# EAGLE design fob (EAGLE 9.6.1)
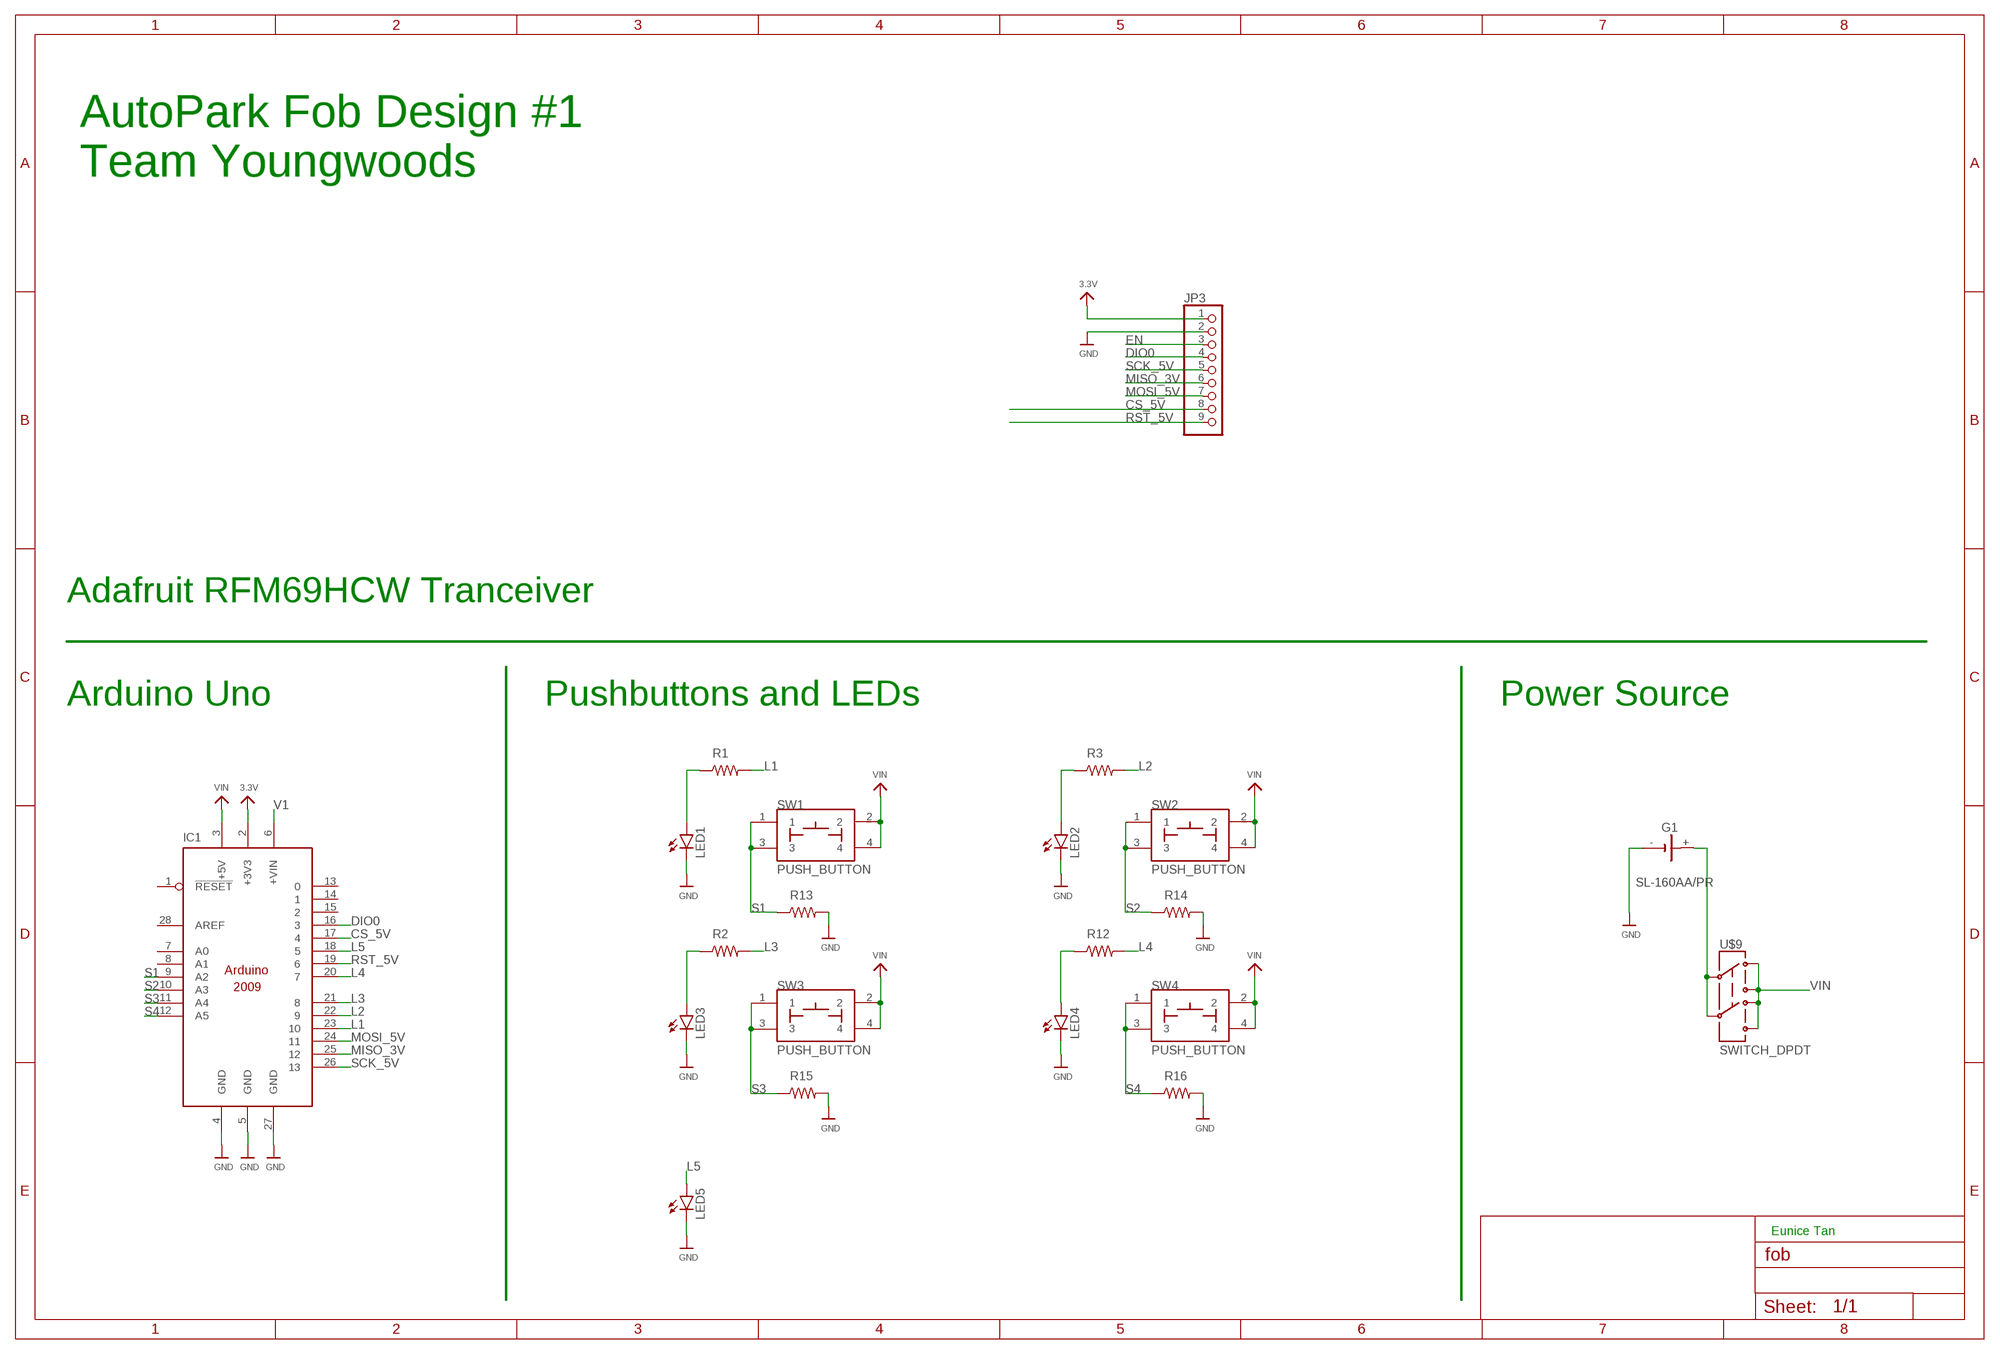
[diagram p0: schematic, sheet 1]

## Parts
G1  SL-160AA/PR  [SL-160AA/PR]
IC1  ARDUINO2009_10  [ARDUINO2009]
JP3  HEADER-1X970MIL  [1X09_ROUND_70]
LED1  LED5MM  [LED5MM]
LED2  LED5MM  [LED5MM]
LED3  LED5MM  [LED5MM]
LED4  LED5MM  [LED5MM]
LED5  LED5MM  [LED5MM]
R1  R_R0805  [R0805]
R2  R_R0805  [R0805]
R3  R_R0805  [R0805]
R12  R_R0805  [R0805]
R13  R_R0805  [R0805]
R14  R_R0805  [R0805]
R15  R_R0805  [R0805]
R16  R_R0805  [R0805]
SW1  PUSH_BUTTON  [BUTTON_12.5MM]
SW2  PUSH_BUTTON  [BUTTON_12.5MM]
SW3  PUSH_BUTTON  [BUTTON_12.5MM]
SW4  PUSH_BUTTON  [BUTTON_12.5MM]
U$9  SWITCH_DPDT  [JS_DPDT_TH]

## Nets
3.3V: IC1.2(+3V3) JP3.1
CS_5V: IC1.17 JP3.8
DIO0: IC1.16 JP3.4
EN: JP3.3
GND: G1.- IC1.4(GND) IC1.5(GND) IC1.27(GND) JP3.2 LED1.K(C) LED2.K(C) LED3.K(C) LED4.K(C) LED5.K(C) R13.2 R14.2 R15.2 R16.2
L1: IC1.23 R1.2
L2: IC1.22 R3.2
L3: IC1.21 R2.2
L4: IC1.20 R12.2
L5: IC1.18 LED5.A
MISO_3V: IC1.25 JP3.6
MOSI_5V: IC1.24 JP3.7
N$1: G1.+ U$9.2 U$9.5
N$4: LED1.A R1.1
N$5: LED3.A R2.1
N$6: LED2.A R3.1
N$7: LED4.A R12.1
RST_5V: IC1.19 JP3.9
S1: IC1.9(A2) R13.1 SW1.1 SW1.3
S2: IC1.10(A3) R14.1 SW2.1 SW2.3
S3: IC1.11(A4) R15.1 SW3.1 SW3.3
S4: IC1.12(A5) R16.1 SW4.1 SW4.3
SCK_5V: IC1.26 JP3.5
V1: IC1.6(+VIN)
VIN: IC1.3(+5V) SW1.2 SW1.4 SW2.2 SW2.4 SW3.2 SW3.4 SW4.2 SW4.4 U$9.1 U$9.3 U$9.4 U$9.6
Unconnected: IC1.1(!RESET) IC1.7(A0) IC1.8(A1) IC1.13 IC1.14 IC1.15 IC1.28(AREF)

## Notes on the sheet
- AutoPark Fob Design #1
  Team Youngwoods
- Adafruit RFM69HCW Tranceiver
- Arduino Uno | Pushbuttons and LEDs | Power Source
- Eunice Tan

## Library data of the parts
G1 = battery:SL-160AA/PR: LI BATTERY Sonnenschein
IC1 = arduino:ARDUINO2009_1: The Arduino Duemilanove ("2009") is a microcontroller board based on the ATmega168 or ATmega328. - 14 digital input/output pins (of which 6 can be used as PWM outputs) - 6 analog inputs, a 16 MHz crystal oscillator - USB connection - power jack - ISP header - reset button It contains everything needed to support the microcontroller; simply connect it to a computer with a USB cable or power it with a AC-to-DC adapter or battery to get started http://arduino.cc/en/Main/ArduinoBoardDuemilanove
JP3 = microbuilder:HEADER-1X9: PIN HEADER
LED1-LED5 = led:LED: LED OSRAM: - CHIPLED LG R971, LG N971, LY N971, LG Q971, LY Q971, LO R971, LY R971 LH N974, LH R974 LS Q976, LO Q976, LY Q976 LO Q996 - Hyper CHIPLED LW Q18S LB Q993, LB Q99A, LB R99A - SideLED LS A670, LO A670, LY A670, LG A670, LP A670 LB A673, LV A673, LT A673, LW A673 LH A674 LY A675 LS A676, LA A676, LO A676, LY A676, LW A676 LS A679, LY A679, LG A679 - Hyper Micro SIDELED® LS Y876, LA Y876, LO Y876, LY Y876 LT Y87S - SmartLED LW L88C, LW L88S LB L89C, LB L89S, LG L890 LS L89K, LO L89K, LY L89K LS L896, LA L896, LO L896, LY L896 - TOPLED LS T670, LO T670, LY T670, LG T670, LP T670 LSG T670, LSP T670, LSY T670, LOP T670, LYG T670 LG T671, LOG T671, LSG T671 LB T673, LV T673, LT T673, LW T673 LH T674 LS T676, LA T676, LO T676, LY T676, LB T676, LH T676, LSB T676, LW T676 LB T67C, LV T67C, LT T67C, LS T67K, LO T67K, LY T67K, LW E67C LS E67B, LA E67B, LO E67B, LY E67B, LB E67C, LV E67C, LT E67C LW T67C LS T679, LY T679, LG T679 LS T770, LO T770, LY T770, LG T770, LP T770 LB T773, LV T773, LT T773, LW T773 LH T774 LS E675, LA E675, LY E675, LS T675 LS T776, LA T776, LO T776, LY T776, LB T776 LHGB T686 LT T68C, LB T68C - Hyper Mini TOPLED® LB M676 - Mini TOPLED Santana® LG M470 LS M47K, LO M47K, LY M47K Source: http://www.osram.convergy.de LUXEON: - LUMILED® LXK2-PW12-R00, LXK2-PW12-S00, LXK2-PW14-U00, LXK2-PW14-V00 LXK2-PM12-R00, LXK2-PM12-S00, LXK2-PM14-U00 LXK2-PE12-Q00, LXK2-PE12-R00, LXK2-PE12-S00, LXK2-PE14-T00, LXK2-PE14-U00 LXK2-PB12-K00, LXK2-PB12-L00, LXK2-PB12-M00, LXK2-PB14-N00, LXK2-PB14-P00, LXK2-PB14-Q00 LXK2-PR12-L00, LXK2-PR12-M00, LXK2-PR14-Q00, LXK2-PR14-R00 LXK2-PD12-Q00, LXK2-PD12-R00, LXK2-PD12-S00 LXK2-PH12-R00, LXK2-PH12-S00 LXK2-PL12-P00, LXK2-PL12-Q00, LXK2-PL12-R00 Source: www.luxeon.com KINGBRIGHT: KA-3528ASYC Source: www.kingbright.com
R1-R3 R12-R16 = MISC:R_: RESISTOR, American symbol
SW1-SW4 = MISC:PUSH_BUTTON
U$9 = ELEC327:SWITCH_DPDT

## Board
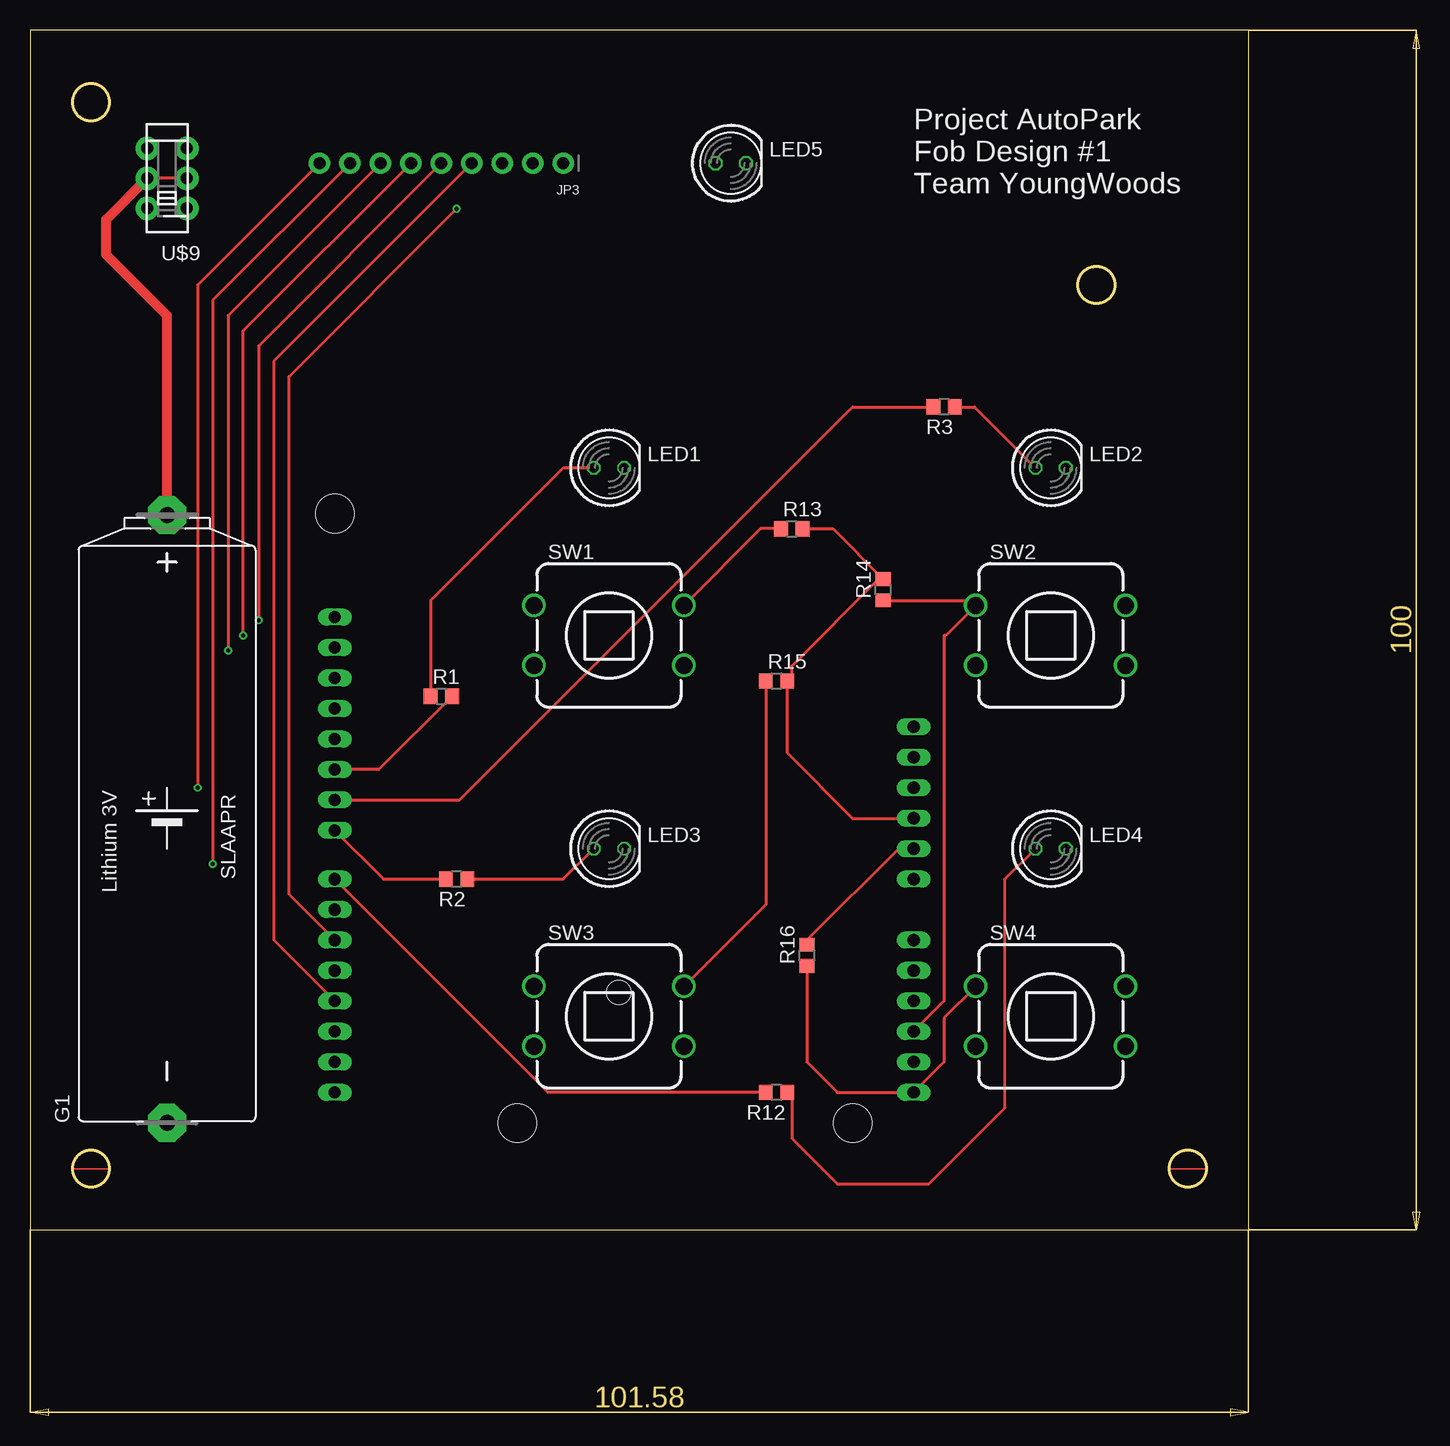
[diagram p1: board, top side]
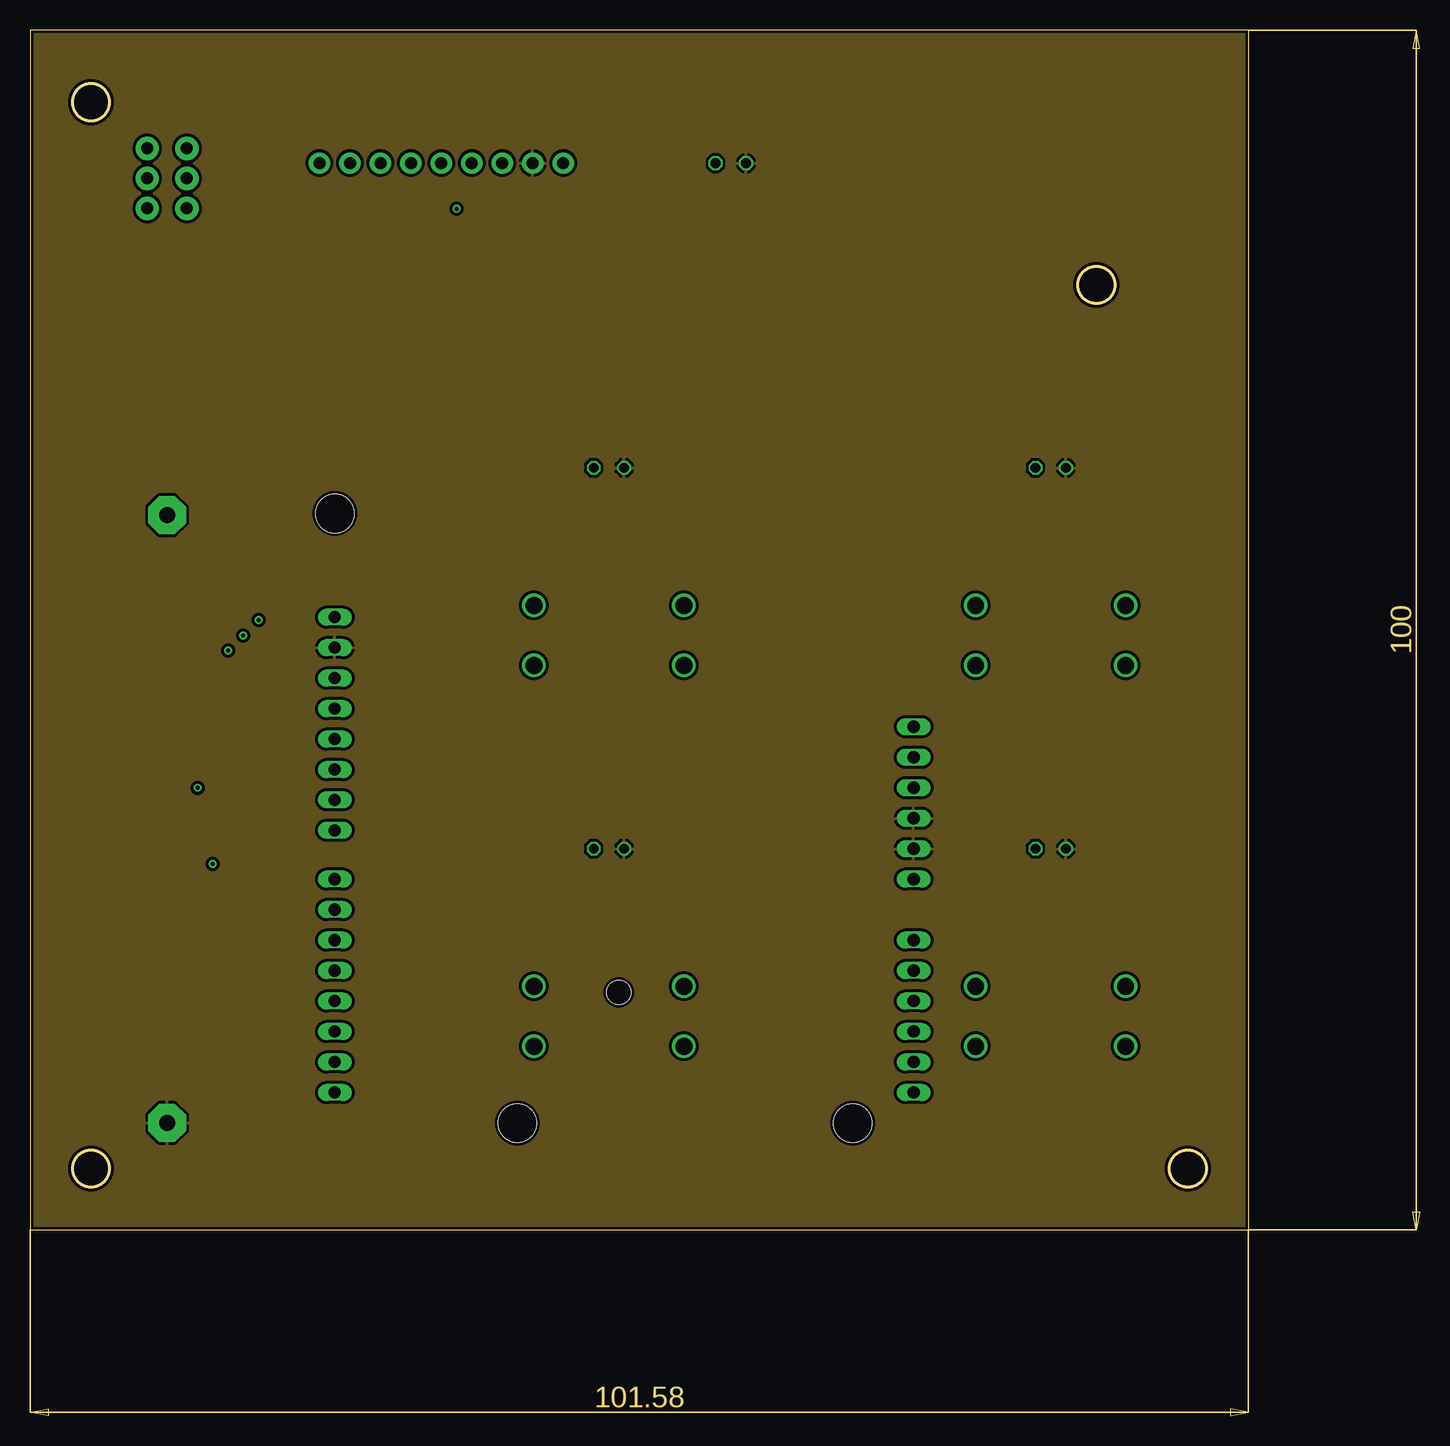
[diagram p2: board, inner layer Route2]
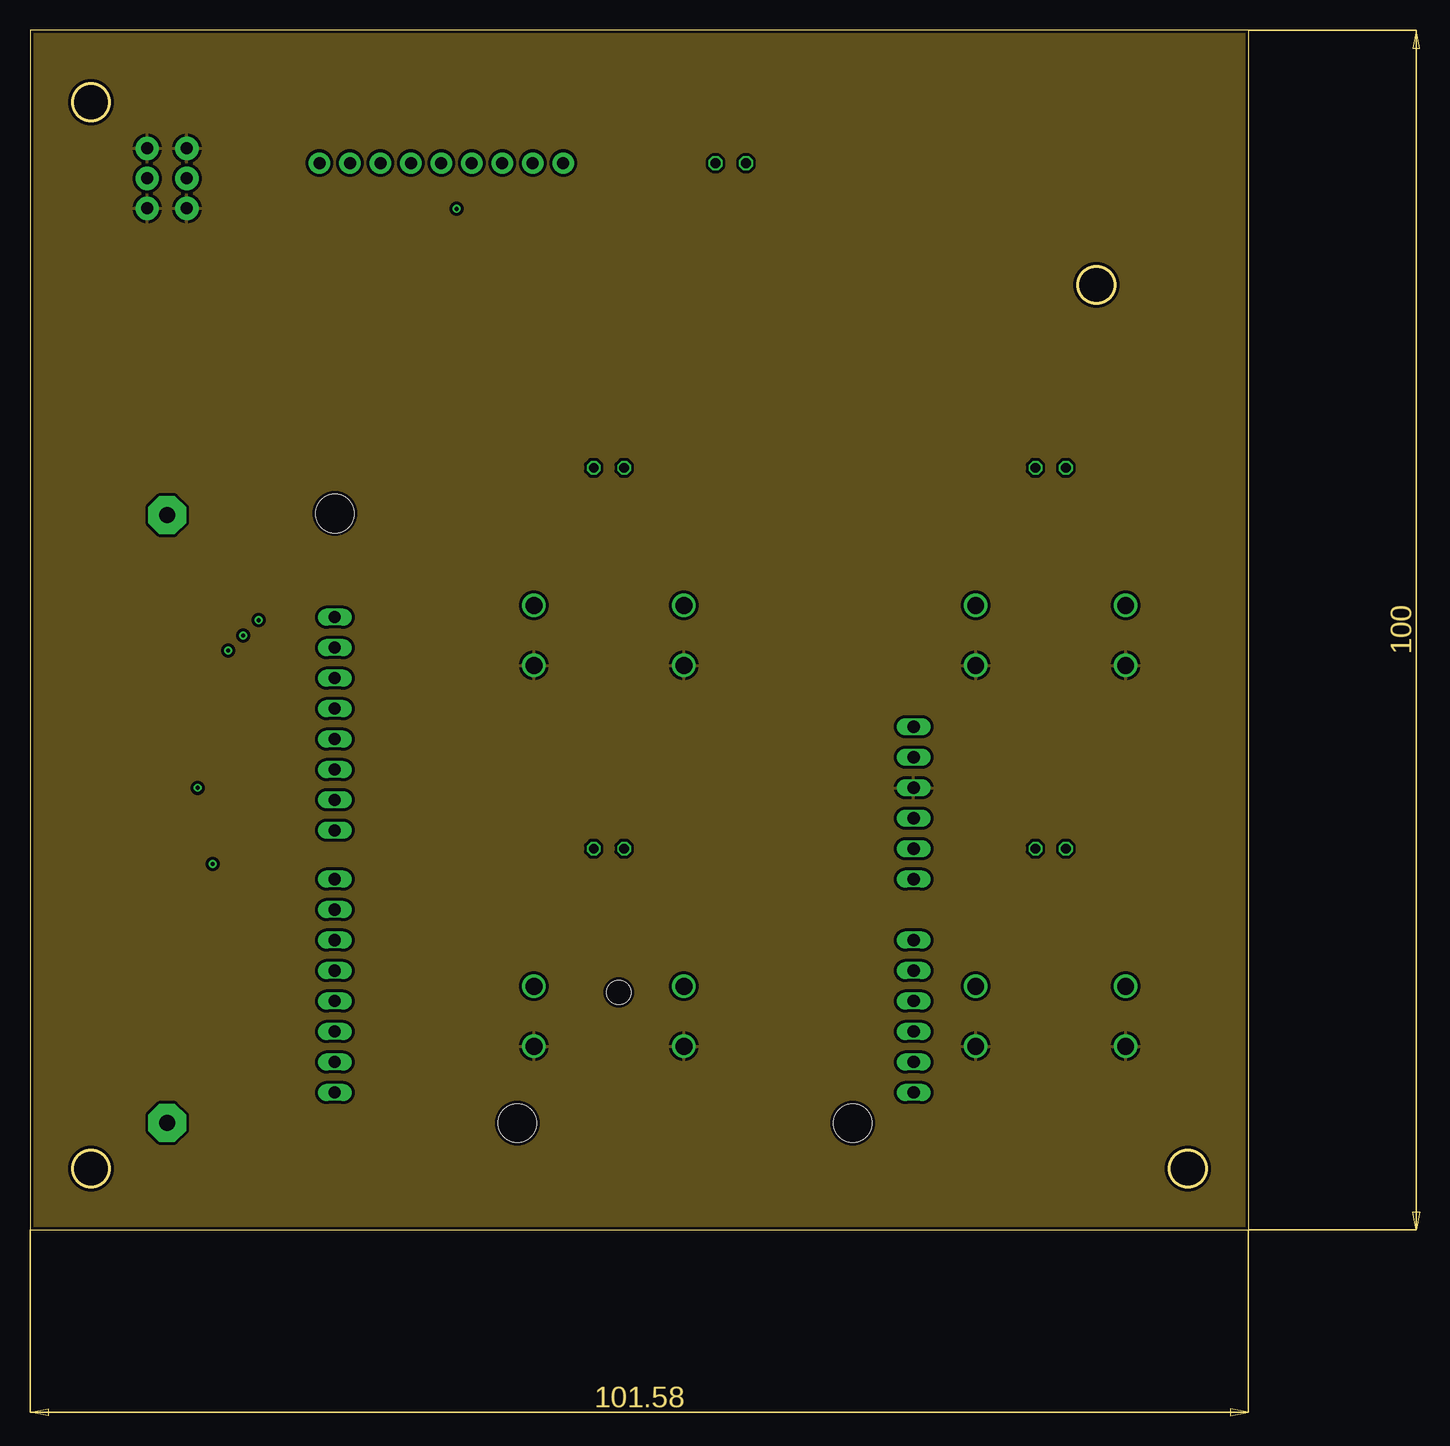
[diagram p3: board, inner layer Route15]
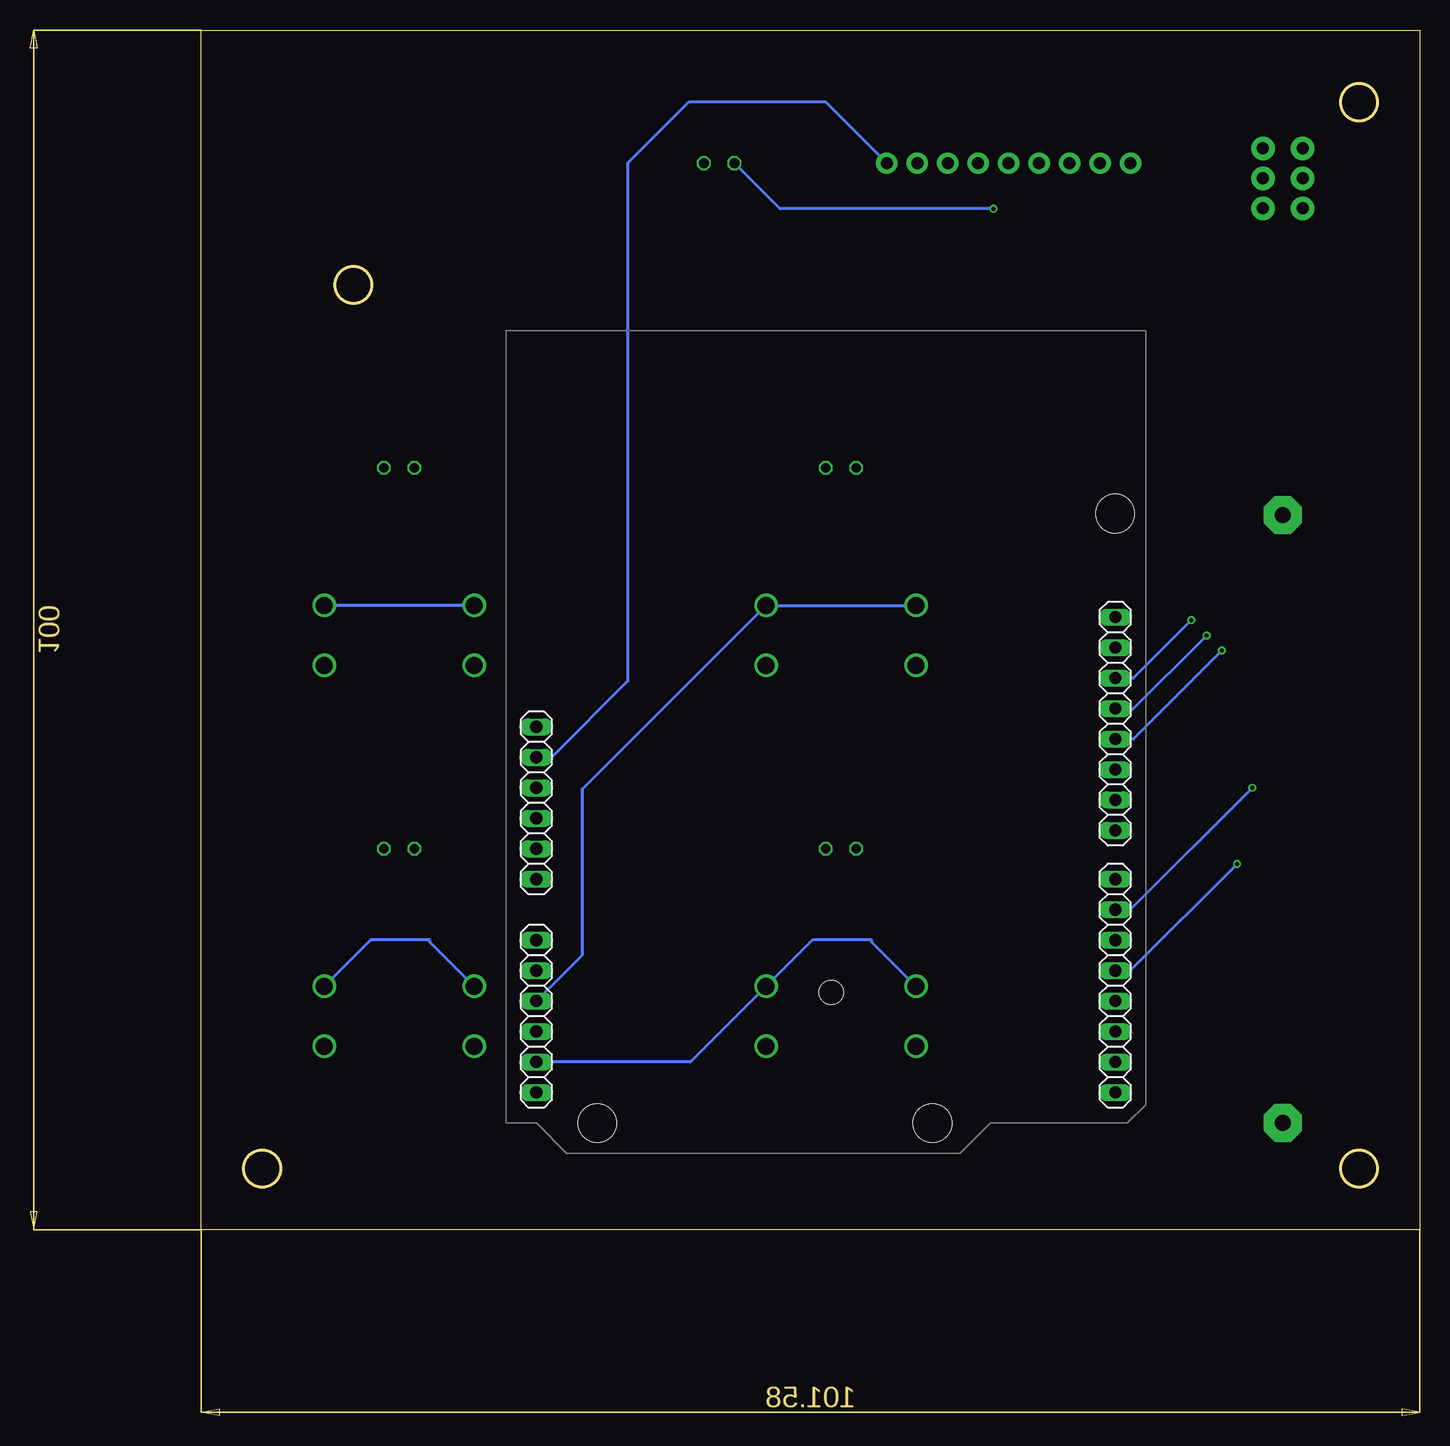
[diagram p4: board, bottom side, seen from below]

Size 101.6 x 100 mm. Coordinates in mm from the lower left corner, seen from the top.
Outline: 0,0 101.6,0 101.6,100 0,100 0,0
Outline: circle at 88.9,78.74 radius 1.52
Outline: circle at 96.52,5.08 radius 1.52
Outline: circle at 5.08,5.08 radius 1.52
Outline: circle at 5.08,93.98 radius 1.52
Copper layers (1*2*15*16): Top 0.035mm / dielectric 0.23mm / Route2 0.035mm / dielectric 0.93mm / Route15 0.035mm / dielectric 0.23mm / Bottom 0.035mm
Design rules "ENGI301_4lyr": minimum track width 10mil, minimum drill 12mil, track to track 10mil, track to pad 10mil, pad to pad 10mil, via to via 10mil, smd to smd 10mil, copper to edge 10mil, drill to drill 12mil, minimum pad ring 6mil, minimum via ring 6mil, stop-mask expansion 3mil, vias tented up to drill 25mil, thermal gap 10mil

### Footprints (pad centres in the part's own frame; a part is rotated, then mirrored left to right if it is on the bottom)
SL-160AA/PR = drill 1.321 pad 3.15 octagon: + 25.273,0; - -25.4,0
ARDUINO2009 = drill 1.016 long: 1 33.02,2.54; 2 35.56,2.54; 3 38.1,2.54; 4 40.64,2.54; 5 43.18,2.54; 6 45.72,2.54; 7 50.8,2.54; 8 53.34,2.54; 9 55.88,2.54; 10 58.42,2.54; 11 60.96,2.54; 12 63.5,2.54; 13 63.5,50.8; 14 60.96,50.8; 15 58.42,50.8; 16 55.88,50.8; 17 53.34,50.8; 18 50.8,50.8; 19 48.26,50.8; 20 45.72,50.8; 21 41.656,50.8; 22 39.116,50.8; 23 36.576,50.8; 24 34.036,50.8; 25 31.496,50.8; 26 28.956,50.8; 27 26.416,50.8; 28 23.876,50.8 | hole 3.2: 15.24,50.8; 66.04,35.56; 66.04,7.62 | hole 2: 55.17,27.114
1X09_ROUND_70 = drill 1 pad 1.778: 1 -10.16,0; 2 -7.62,0; 3 -5.08,0; 4 -2.54,0; 5 0,0; 6 2.54,0; 7 5.08,0; 8 7.62,0; 9 10.16,0
LED5MM = drill 0.813 octagon: A -1.27,0; K 1.27,0
R0805 = smd 1.143 x 1.27: 1 -0.889,0; 2 0.889,0
BUTTON_12.5MM = drill 1.4: 1 -6.25,2.5; 2 -6.25,-2.5; 3 6.25,2.5; 4 6.25,-2.5
JS_DPDT_TH = drill 1 pad 1.93: 1 -2.5,-1.65; 2 0,-1.65; 3 2.5,-1.65; 4 -2.5,1.65; 5 0,1.65; 6 2.5,1.65

### Placement (x,y rotation side)
G1  11.43,34.29 90 top
IC1  76.2,74.93 270 bottom
JP3  34.29,88.9 180 top
LED1  48.26,63.5 0 top
LED2  85.09,63.5 0 top
LED3  48.26,31.75 0 top
LED4  85.09,31.75 0 top
LED5  58.42,88.9 0 top
R1  34.29,44.45 0 top
R2  35.56,29.21 180 top
R3  76.2,68.58 180 top
R12  62.23,11.43 180 top
R13  63.5,58.42 0 top
R14  71.12,53.34 90 top
R15  62.23,45.72 0 top
R16  64.77,22.86 90 top
SW1  48.26,49.53 0 top
SW2  85.09,49.53 0 top
SW3  48.26,17.78 0 top
SW4  85.09,17.78 0 top
U$9  11.43,87.63 90 top

### Tracks (layer width: path | path; a pad name or v marks a point on that pad's centre or on a via)
3.3V
  Bottom 0.254: JP3.1 49.53,93.98 60.96,93.98 66.04,88.9 66.04,45.72 72.39,39.37 IC1.2
CS_5V  (via drill 0.35)
  Top 0.254: JP3.8 15.24,77.47 v15.24,30.48
  Bottom 0.254: v15.24,30.48 24.13,21.59 IC1.17
DIO0
  Top 0.254: JP3.4 20.32,72.39 20.32,24.13 IC1.16
GND
  Top 0.254: R13.2 66.93,58.42 R14.2 70.74,54.23 63.5,46.99 63.5,46.1 R15.2 63.12,39.75 68.58,34.29 IC1.4 | IC1.5 72.39,31.75 64.77,24.13 R16.2
  pour Route2: -1.27,101.6 102.87,101.6 104.14,100.33 104.14,-2.54 -1.27,-2.54 -2.54,-1.27 -2.54,100.33
L1
  Top 0.254: R1.2 29.08,38.35 IC1.23
L2
  Top 0.254: IC1.22 35.81,35.81 68.58,68.58 R3.2
L3
  Top 0.254: IC1.21 29.46,29.21 R2.2
L4
  Top 0.254: R12.2 43.18,11.43 IC1.20
L5  (via drill 0.35)
  Top 0.254: IC1.18 21.59,27.94 21.59,71.12 v35.56,85.09
  Bottom 0.254: v35.56,85.09 53.34,85.09 LED5.A
MISO_3V  (via drill 0.35)
  Top 0.254: v17.78,49.53 17.78,74.93 JP3.6
  Bottom 0.254: IC1.25 24.38,43.43 24.13,43.18 v17.78,49.53
MOSI_5V  (via drill 0.35)
  Top 0.254: JP3.7 16.51,76.2 v16.51,48.26
  Bottom 0.254: v16.51,48.26 23.88,40.89 IC1.24
N$1
  Top 0.254: U$9.2 U$9.5
  Top 0.813: G1.+ 11.43,76.2 6.35,81.28 6.35,84.2 U$9.5
N$4
  Top 0.254: LED1.A 44.45,63.5 33.4,52.45 R1.1
N$5
  Top 0.254: R2.1 44.45,29.21 LED3.A
N$6
  Top 0.254: R3.1 78.74,68.58 LED2.A
N$7
  Top 0.254: R12.1 63.5,11.05 63.5,7.62 67.31,3.81 74.93,3.81 81.28,10.16 81.28,29.21 LED4.A
RST_5V  (via drill 0.35)
  Top 0.254: JP3.9 13.97,78.74 v13.97,36.83
  Bottom 0.254: v13.97,36.83 24.13,26.67 IC1.19
S1
  Top 0.254: SW1.3 60.9,58.42 R13.1
  Bottom 0.254: SW1.1 SW1.3 69.85,36.69 69.85,22.86 IC1.9
S2
  Top 0.254: R14.1 78.42,52.45 SW2.1 76.34,49.53 76.2,49.53 76.2,19.05 IC1.10
  Bottom 0.254: SW2.1 SW2.3
S3
  Top 0.254: R15.1 61.34,27.11 SW3.3
  Bottom 0.254: SW3.1 45.72,23.99 45.72,24.13 50.66,24.13 SW3.3 60.82,13.97 IC1.11
S4
  Top 0.254: R16.1 64.77,13.97 67.31,11.43 IC1.12 76.2,13.97 76.2,17.64 SW4.1
  Bottom 0.254: SW4.1 82.55,23.99 82.55,24.13 87.49,24.13 SW4.3
SCK_5V  (via drill 0.35)
  Top 0.254: JP3.5 19.05,73.66 v19.05,50.8
  Bottom 0.254: IC1.26 23.88,45.97 v19.05,50.8
VIN
  pour Route15: -1.27,-1.27 101.6,-1.27 102.87,0 102.87,101.6 0,101.6 -1.27,100.33
(copper drawn outside any net)
  shapes: Top area x2

### Text on the board
tPlace: Project AutoPark / Fob Design #1 / Team YoungWoods